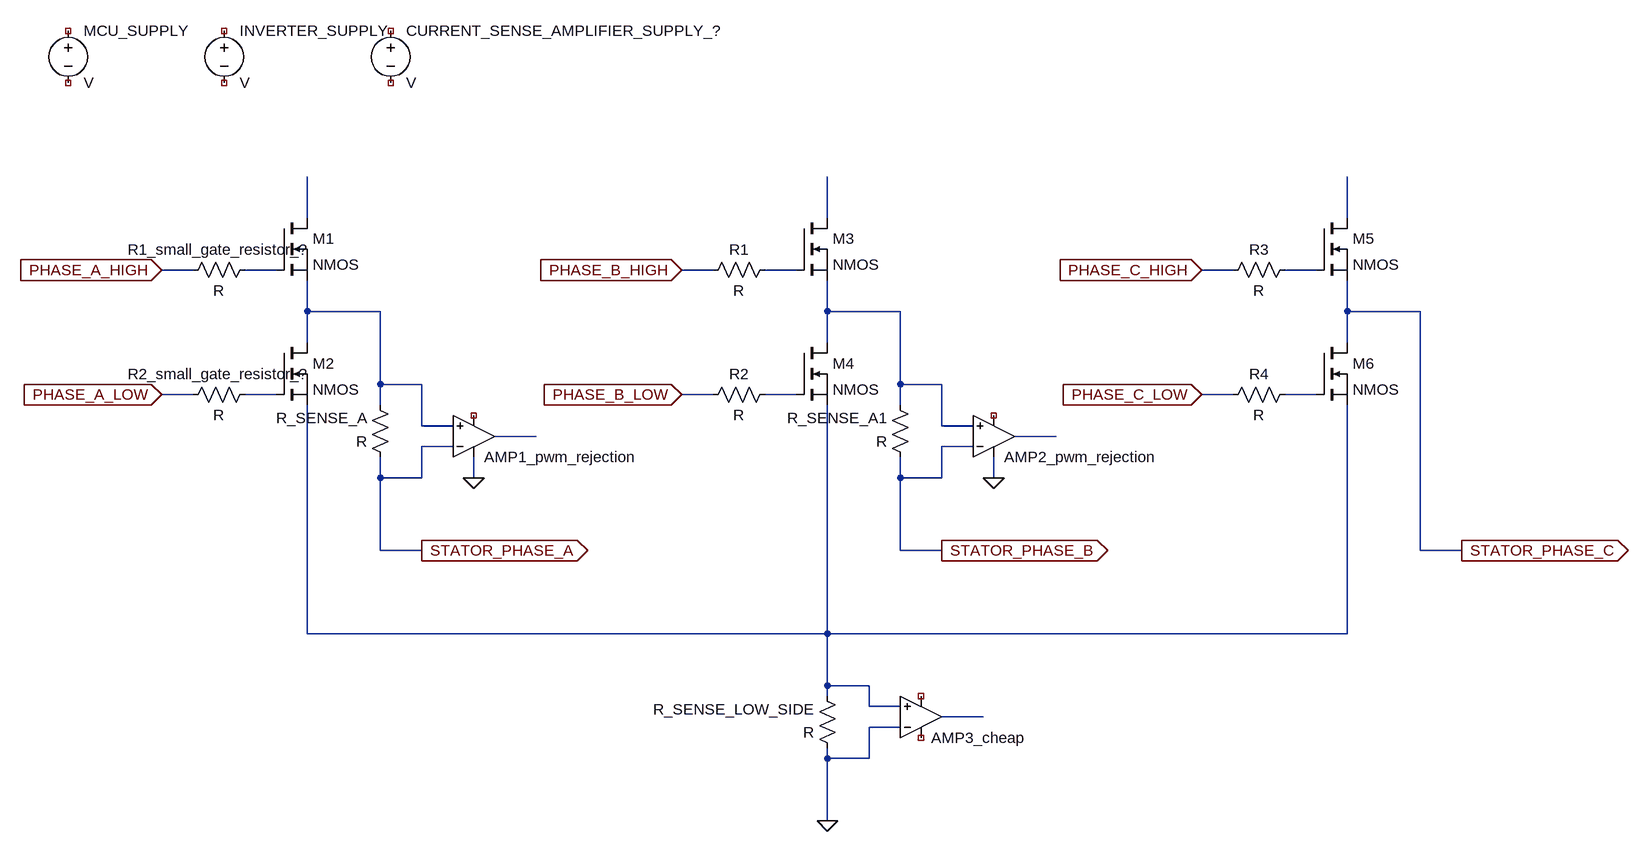
[diagram p0: schematic driver-inverter-motor.asc]
driver-inverter-motor.asc, the LTspice schematic file:
Version 4
SHEET 1 2372 748
WIRE 368 -192 368 -256
WIRE 1168 -192 1168 -256
WIRE 1968 -192 1968 -256
WIRE 192 -112 144 -112
WIRE 320 -112 272 -112
WIRE 992 -112 944 -112
WIRE 1120 -112 1072 -112
WIRE 1792 -112 1744 -112
WIRE 1920 -112 1872 -112
WIRE 368 -48 368 -96
WIRE 480 -48 368 -48
WIRE 1168 -48 1168 -96
WIRE 1280 -48 1168 -48
WIRE 1968 -48 1968 -96
WIRE 2080 -48 1968 -48
WIRE 368 0 368 -48
WIRE 1168 0 1168 -48
WIRE 1968 0 1968 -48
WIRE 480 64 480 -48
WIRE 544 64 480 64
WIRE 1280 64 1280 -48
WIRE 1344 64 1280 64
WIRE 192 80 144 80
WIRE 320 80 272 80
WIRE 992 80 944 80
WIRE 1120 80 1072 80
WIRE 1792 80 1744 80
WIRE 1920 80 1872 80
WIRE 480 96 480 64
WIRE 1280 96 1280 64
WIRE 544 128 544 64
WIRE 592 128 544 128
WIRE 1344 128 1344 64
WIRE 1392 128 1344 128
WIRE 720 144 656 144
WIRE 1520 144 1456 144
WIRE 592 160 544 160
WIRE 1392 160 1344 160
WIRE 480 208 480 176
WIRE 544 208 544 160
WIRE 544 208 480 208
WIRE 624 208 624 176
WIRE 1280 208 1280 176
WIRE 1344 208 1344 160
WIRE 1344 208 1280 208
WIRE 1424 208 1424 176
WIRE 480 320 480 208
WIRE 544 320 480 320
WIRE 1280 320 1280 208
WIRE 1344 320 1280 320
WIRE 2080 320 2080 -48
WIRE 2144 320 2080 320
WIRE 368 448 368 96
WIRE 1168 448 1168 96
WIRE 1168 448 368 448
WIRE 1968 448 1968 96
WIRE 1968 448 1168 448
WIRE 1168 528 1168 448
WIRE 1232 528 1168 528
WIRE 1168 544 1168 528
WIRE 1232 560 1232 528
WIRE 1280 560 1232 560
WIRE 1408 576 1344 576
WIRE 1280 592 1232 592
WIRE 1168 640 1168 624
WIRE 1232 640 1232 592
WIRE 1232 640 1168 640
WIRE 1168 736 1168 640
FLAG 144 -112 PHASE_A_HIGH
IOPIN 144 -112 In
FLAG 144 80 PHASE_A_LOW
IOPIN 144 80 In
FLAG 544 320 STATOR_PHASE_A
IOPIN 544 320 Out
FLAG 624 208 0
FLAG 944 -112 PHASE_B_HIGH
IOPIN 944 -112 In
FLAG 944 80 PHASE_B_LOW
IOPIN 944 80 In
FLAG 1344 320 STATOR_PHASE_B
IOPIN 1344 320 Out
FLAG 1744 -112 PHASE_C_HIGH
IOPIN 1744 -112 In
FLAG 1744 80 PHASE_C_LOW
IOPIN 1744 80 In
FLAG 2144 320 STATOR_PHASE_C
IOPIN 2144 320 Out
FLAG 1168 736 0
FLAG 1424 208 0
SYMBOL nmos 320 -192 R0
SYMATTR InstName M1
SYMBOL nmos 320 0 R0
SYMATTR InstName M2
SYMBOL res 288 -128 R90
WINDOW 0 0 56 VBottom 2
WINDOW 3 32 56 VTop 2
SYMATTR InstName R1_small_gate_resistor_?
SYMBOL res 288 64 R90
WINDOW 0 0 56 VBottom 2
WINDOW 3 32 56 VTop 2
SYMATTR InstName R2_small_gate_resistor_?
SYMBOL voltage 240 -496 R0
SYMATTR InstName INVERTER_SUPPLY
SYMBOL voltage 496 -496 R0
SYMATTR InstName CURRENT_SENSE_AMPLIFIER_SUPPLY_?
SYMBOL voltage 0 -496 R0
SYMATTR InstName MCU_SUPPLY
SYMBOL res 496 192 R180
WINDOW 0 36 76 Left 2
WINDOW 3 36 40 Left 2
SYMATTR InstName R_SENSE_A
SYMBOL OpAmps\\UniversalOpAmp 624 144 M180
SYMATTR InstName AMP1_pwm_rejection
SYMBOL nmos 1120 -192 R0
SYMATTR InstName M3
SYMBOL nmos 1120 0 R0
SYMATTR InstName M4
SYMBOL res 1088 -128 R90
WINDOW 0 0 56 VBottom 2
WINDOW 3 32 56 VTop 2
SYMATTR InstName R1
SYMBOL res 1088 64 R90
WINDOW 0 0 56 VBottom 2
WINDOW 3 32 56 VTop 2
SYMATTR InstName R2
SYMBOL nmos 1920 -192 R0
SYMATTR InstName M5
SYMBOL nmos 1920 0 R0
SYMATTR InstName M6
SYMBOL res 1888 -128 R90
WINDOW 0 0 56 VBottom 2
WINDOW 3 32 56 VTop 2
SYMATTR InstName R3
SYMBOL res 1888 64 R90
WINDOW 0 0 56 VBottom 2
WINDOW 3 32 56 VTop 2
SYMATTR InstName R4
SYMBOL res 1184 640 R180
WINDOW 0 36 76 Left 2
WINDOW 3 36 40 Left 2
SYMATTR InstName R_SENSE_LOW_SIDE
SYMBOL OpAmps\\UniversalOpAmp 1312 576 M180
SYMATTR InstName AMP3_cheap
SYMBOL res 1296 192 R180
WINDOW 0 36 76 Left 2
WINDOW 3 36 40 Left 2
SYMATTR InstName R_SENSE_A1
SYMBOL OpAmps\\UniversalOpAmp 1424 144 M180
SYMATTR InstName AMP2_pwm_rejection

The netlist it stands for:
* driver-inverter-motor.asc
M1 N001 N004 N007 N007 NMOS
M2 N007 N009 N014 N014 NMOS
R1_small_gate_resistor_? N004 PHASE_A_HIGH R
R2_small_gate_resistor_? N009 PHASE_A_LOW R
V§INVERTER_SUPPLY NC_01 NC_02 V
V§CURRENT_SENSE_AMPLIFIER_SUPPLY_? NC_03 NC_04 V
V§MCU_SUPPLY NC_05 NC_06 V
R_SENSE_A STATOR_PHASE_A N007 R
XAMP1_pwm_rejection N007 STATOR_PHASE_A 0 NC_07 N012 level1 Avol=1Meg GBW=10Meg Vos=0 En=0 Enk=0 In=0 Ink=0 Rin=500Meg  ; pins In+ In- V+ V- OUT
M3 N002 N005 N008 N008 NMOS
M4 N008 N010 N014 N014 NMOS
R1 N005 PHASE_B_HIGH R
R2 N010 PHASE_B_LOW R
M5 N003 N006 STATOR_PHASE_C STATOR_PHASE_C NMOS
M6 STATOR_PHASE_C N011 N014 N014 NMOS
R3 N006 PHASE_C_HIGH R
R4 N011 PHASE_C_LOW R
R_SENSE_LOW_SIDE 0 N014 R
XAMP3_cheap N014 0 NC_08 NC_09 N015 level1 Avol=1Meg GBW=10Meg Vos=0 En=0 Enk=0 In=0 Ink=0 Rin=500Meg  ; pins In+ In- V+ V- OUT
R_SENSE_A1 STATOR_PHASE_B N008 R
XAMP2_pwm_rejection N008 STATOR_PHASE_B 0 NC_10 N013 level1 Avol=1Meg GBW=10Meg Vos=0 En=0 Enk=0 In=0 Ink=0 Rin=500Meg  ; pins In+ In- V+ V- OUT
.model NMOS NMOS
.model PMOS PMOS
.lib standard.mos
.lib UniversalOpAmp1.lib
.backanno
.end